# Altium schematic sheet 2_FET_B.SchDoc
size A4; SheetNumber: 4; SheetTotal: 7
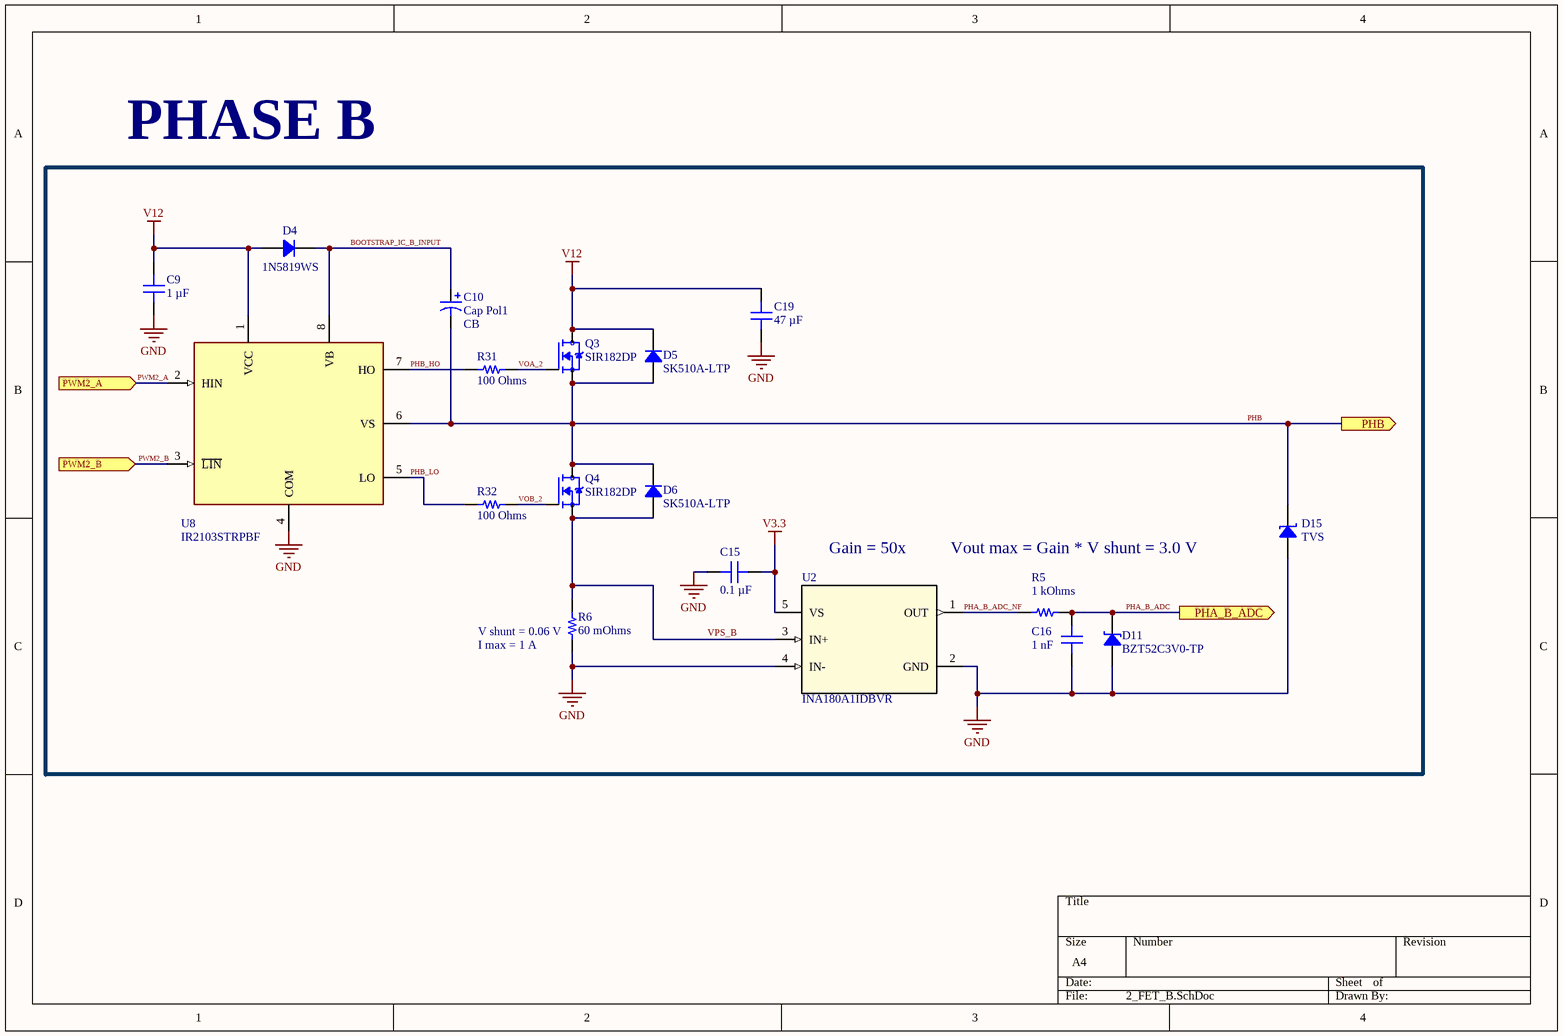
[diagram p0: 2_FET_B.SchDoc]

## Parts
C9  1 µF  [CAP 0805_2012]
C10  Cap Pol1  value CB  [CapacitorRadialElectrolytic]
C15  0.1 µF  [CAP 0805_2012]
C16  1 nF  [CAP 0805_2012]
C19  47 µF  [CAP 1812_4532 1.1MM]
D4  1N5819WS  [SOD-123]
D5  SK510A-LTP  [DO214AC SMA]
D6  SK510A-LTP  [DO214AC SMA]
D11  BZT52C3V0-TP  [SOD-123]
D15  TVS  [SMF DO-219AB]
Q3  SIR182DP  [TRANS_SIR182DP-T1-RE3]
Q4  SIR182DP  [TRANS_SIR182DP-T1-RE3]
R5  1 kOhms  [RES 0805_2012]
R6  60 mOhms  [STACKPOLE CSR2512]
R31  100 Ohms  [RES 0805_2012]
R32  100 Ohms  [RES 0805_2012]
U2  INA180A1IDBVR  [DBV0005A_N]
U8  IR2103STRPBF  [SOIC8_IR2103STRPBF]

## Ports
PHA_B_ADC (out), PHB (out), PWM2_A (in), PWM2_B (in)

## Nets
GND: C9.1 C15.2 C16.2 C19.1 D11.1 D15.1 R6.1 U2.2(GND) U2.4(IN-) U8.4(COM)
V3.3: C15.1 U2.5(VS)
V12: C9.2 C19.2 D4.1 D5.2 Q3.5(D) Q3.6(D) Q3.7(D) Q3.8(D) Q3.9(D) U8.1(VCC)
BOOTSTRAP_IC_B_INPUT: C10.1 D4.2 U8.8(VB)
PHA_B_ADC: C16.1 D11.2 R5.1 ; port PHA_B_ADC
PHA_B_ADC_NF: R5.2 U2.1(OUT)
PHB: C10.2 D5.1 D6.2 D15.2 Q3.1(S) Q3.2(S) Q3.3(S) Q4.5(D) Q4.6(D) Q4.7(D) Q4.8(D) Q4.9(D) U8.6(VS) ; port PHB
PHB_HO: R31.2 U8.7(HO)
PHB_LO: R32.2 U8.5(LO)
PWM2_A: U8.2(HIN) ; port PWM2_A
PWM2_B: U8.3(~{LIN}) ; port PWM2_B
VOA_2: Q3.4(G) R31.1
VOB_2: Q4.4(G) R32.1
VPS_B: D6.1 Q4.1(S) Q4.2(S) Q4.3(S) R6.2 U2.3(IN+)

## Notes on the sheet
- PHASE B
- Gain = 50x
- Vout max = Gain * V shunt = 3.0 V
- (near R6) V shunt = 0.06 V
- (near R6) I max = 1 A

## Library data of the parts
C9 C16 = CC0805MRX7R9BB104: CAP CER 0.1UF 50V X7R 0805; manufacturer: Yageo; Capacitance: 0.1 µF; Tolerance: ±20%; Part Number: CC0805MRX7R9BB104; Applications: General Purpose; componentlink1description: Datasheet; componentlink1url: https://www.yageo.com/upload/media/product/productsearch/datasheet/mlcc/UPY-GPHC_X7R_6.3V-to-50V_18.pdf; componentlink2description: DigiKey Link; componentlink2url: https://www.digikey.com/en/products/detail/yageo/CC0805MRX7R9BB104/5884281; Device Package: 0805 (2012 Metric); lastupdated: 15/11/2023 20:14:20; Lifecycle Status: Active; Minimum Order: 1; Mounting Type: Surface Mount, MLCC; Operating Temperature: -55°C ~ 125°C; Package / Case: 0805 (2012 Metric); packaging: TapeAndReel; partid: 2475; Part Status: Active; price: 0.01; series: CC; Size / Dimension: 0.079" L x 0.049" W (2.00mm x 1.25mm); Supplier 1: DigiKey; Supplier Part Number 1: 311-4351-1-ND; Temperature Coefficient: X7R; Thickness (Max): 0.037" (0.95mm); Voltage - Rated: 50V
  C9: Value: 1 µF
  C16: Value: 1 nF
C10 = Cap Pol1: Polarized Capacitor (Radial); Published: 8-Jun-2000; LatestRevisionDate: 17-Jul-2002; LatestRevisionNote: Re-released for DXP Platform.; PackageReference: RB7.6-15; Publisher: Altium Limited; PackageDescription: Polarized Capacitor (Radial); 2 Leads
C15 = CC0805MRX7R9BB104: CAP CER 0.1UF 50V X7R 0805; manufacturer: Yageo; Tolerance: ±20%; Part Number: CC0805MRX7R9BB104; Value: 0.1 µF; Applications: General Purpose; Capacitance: 0.1 µF; componentlink1description: Datasheet; componentlink1url: https://www.yageo.com/upload/media/product/productsearch/datasheet/mlcc/UPY-GPHC_X7R_6.3V-to-50V_18.pdf; componentlink2description: DigiKey Link; componentlink2url: https://www.digikey.com/en/products/detail/yageo/CC0805MRX7R9BB104/5884281; Device Package: 0805 (2012 Metric); lastupdated: 15/11/2023 20:14:20; Lifecycle Status: Active; Minimum Order: 1; Mounting Type: Surface Mount, MLCC; Operating Temperature: -55°C ~ 125°C; Package / Case: 0805 (2012 Metric); packaging: TapeAndReel; partid: 2475; Part Status: Active; price: 0.01; series: CC; Size / Dimension: 0.079" L x 0.049" W (2.00mm x 1.25mm); Supplier 1: DigiKey; Supplier Part Number 1: 311-4351-1-ND; Temperature Coefficient: X7R; Thickness (Max): 0.037" (0.95mm); Voltage - Rated: 50V
C19 = GMC43X5R476M6R3NT: CAP1812 X5R 47UF 20% 6.3V; manufacturer: Cal-Chip Electronics, Inc.; Part Number: GMC43X5R476M6R3NT; Value: 47 µF; Applications: General Purpose; Capacitance: 47 µF; componentlink1description: Datasheet; componentlink1url: https://88ce57.p3cdn1.secureserver.net/wp-content/uploads/2023/01/gmc_series-2.pdf; componentlink2description: DigiKey Link; componentlink2url: https://www.digikey.com/en/products/detail/cal-chip-electronics-inc/GMC43X5R476M6R3NT/18151147; Device Package: 1812 (4532 Metric); lastupdated: 04/06/2024 19:21:41; Lifecycle Status: Active; Minimum Order: 1; Mounting Type: Surface Mount, MLCC; Operating Temperature: -55°C ~ 85°C; Package / Case: 1812 (4532 Metric); packaging: TapeAndReel; Part Status: Active; price: 0.38; series: GMC; Size / Dimension: 0.177" L x 0.126" W (4.50mm x 3.20mm); Supplier 1: DigiKey; Supplier Part Number 1: 4713-GMC43X5R476M6R3NTCT-ND; Temperature Coefficient: X5R; Thickness (Max): 0.122" (3.10mm); Tolerance: ±20%; Voltage - Rated: 6.3V
D4 = 1N5819HW-7-F: DIODE SCHOTTKY 40V 1A SOD123; Manufacturer: Diodes Incorporated; Capacitance @ Vr, F: 60pF @ 4V, 1MHz; Current - Reverse Leakage @ Vr: 1 mA @ 40 V; Speed: Fast Recovery =< 500ns, > 200mA (Io); Voltage - Forward (Vf) (Max) @ If: 450 mV @ 1 A; Part Number: 1N5819HW-7-F; ComponentLink1Description: Datasheet; ComponentLink1URL: https://www.diodes.com/assets/Datasheets/ds30217.pdf; ComponentLink2Description: DigiKey Link; ComponentLink2URL: https://www.digikey.com/en/products/detail/diodes-incorporated/1N5819HW-7-F/814970; Current - Average Rectified (Io): 1A; Diode Type: Schottky; LastUpdated: 11/03/2024 7:46:34; Lifecycle Status: Active; Minimum Order: 1; Mounting Type: Surface Mount; Operating Temperature - Junction: -65°C ~ 125°C; Package / Case: SOD-123; Packaging: TapeAndReel; PartId: 2212; Part Status: Active; Price: 0.05; Series: -; Supplier 1: DigiKey; Supplier Part Number 1: 1N5819HW-FDICT-ND; Supplier Device Package: SOD-123; Voltage - DC Reverse (Vr) (Max): 40 V
D5 D6 = SK510A-LTP: DIODE SCHOTTKY 100V 5A DO214AC; Manufacturer: Micro Commercial Co; Capacitance @ Vr, F: 200pF @ 4V, 1MHz; Current - Reverse Leakage @ Vr: 1 mA @ 100 V; Speed: Fast Recovery =< 500ns, > 200mA (Io); Voltage - Forward (Vf) (Max) @ If: 850 mV @ 5 A; Part Number: SK510A-LTP; ComponentLink1Description: Datasheet; ComponentLink1URL: https://www.mccsemi.com/pdf/Products/SK52A-L-SK510A-L(DO-214AC).pdf; ComponentLink2Description: DigiKey Link; ComponentLink2URL: https://www.digikey.com/en/products/detail/micro-commercial-co/SK510A-LTP/5114130; Current - Average Rectified (Io): 5A; Diode Type: Schottky; LastUpdated: 29/12/2023 21:23:09; Lifecycle Status: Active; Minimum Order: 1; Mounting Type: Surface Mount; Operating Temperature - Junction: -55°C ~ 150°C; Package / Case: DO-214AC, SMA; Packaging: TapeAndReel; PartId: 2009; Part Status: Active; Price: 0.08; Series: -; Supplier 1: DigiKey; Supplier Part Number 1: SK510A-LTPMSCT-ND; Supplier Device Package: DO-214AC (SMA); Voltage - DC Reverse (Vr) (Max): 100 V
D11 = BZT52C3V0-TP: DIODE ZENER 3V 200MW SOD123; Manufacturer: Micro Commercial Co; Current - Reverse Leakage @ Vr: 10 µA @ 1 V; Impedance (Max) (Zzt): 95 Ohms; Tolerance: ±7%; Voltage - Forward (Vf) (Max) @ If: 900 mV @ 10 mA; Part Number: BZT52C3V0-TP; ComponentLink1Description: Datasheet; ComponentLink1URL: https://www.mccsemi.com/pdf/Products/BZT52C2V4~BZT52C51(500mW)(SOD-123).pdf; ComponentLink2Description: DigiKey Link; ComponentLink2URL: https://www.digikey.com/en/products/detail/micro-commercial-co/BZT52C3V0-TP/806039; LastUpdated: 27/12/2023 21:24:01; Lifecycle Status: Active; Minimum Order: 1; Mounting Type: Surface Mount; Operating Temperature: -65°C ~ 150°C; Package / Case: SOD-123; Packaging: TapeAndReel; PartId: 2097; Part Status: Active; Power - Max: 200 mW; Price: 0.01; Series: -; Supplier 1: DigiKey; Supplier Part Number 1: BZT52C3V0-TPMSCT-ND; Supplier Device Package: SOD-123; Voltage - Zener (Nom) (Vz): 3 V
D15 = VTVS58ASMF-HM3-08: TVS DIODE 57.6V 98V DO219AB; Manufacturer: Vishay Semiconductor Diodes Division; Capacitance @ Frequency: 245pF @ 1MHz; Current - Peak Pulse (10/1000µs): 3.89A; Power Line Protection: No; Power - Peak Pulse: 400W; Type: DO-219AB; Unidirectional Channels: 1; Voltage - Breakdown (Min): 64.6V; Part Number: VTVS58ASMF-HM3-08; Applications: Automotive; ComponentLink1Description: Datasheet; ComponentLink1URL: http://www.vishay.com/docs/85891/vtvs3v3asmf.pdf; ComponentLink2Description: DigiKey Link; ComponentLink2URL: http://digikey.com/product-detail/en/vishay-semiconductor-diodes-division/VTVS58ASMF-HM3-08/112-VTVS58ASMF-HM3-08CT-ND/11562600; LastUpdated: 11/03/2024 8:09:28; Lifecycle Status: Active; Minimum Order: 0; Mounting Type: Surface Mount; Operating Temperature: -55°C ~ 175°C (TJ); Package / Case: DO-219AB; Packaging: TapeAndReel; PartId: 5476; Part Status: -55°C ~ 175°C (TJ); Price: 0.10; Series: Automotive, AEC-Q101, TransZorb®; Supplier 1: DigiKey; Supplier Part Number 1: 112-VTVS58ASMF-HM3-08CT-ND; Supplier Device Package: DO-219AB (SMF); Voltage - Clamping (Max) @ Ipp: 98V; Voltage - Reverse Standoff (Typ): 57.6V
Q3 Q4 = SIR182DP-T1-RE3: N-Channel 60V 60A _Tc_ 69.4W _Tc_ Surface Mount PowerPAKÂ® SO-8; MF: Vishay Siliconix; SnapEDA_Link: https://www.snapeda.com/parts/SIR182DP-T1-RE3/Vishay%20Siliconix/view-part/3228614/?ref=snap; Availability: Unavailable; MP: SIR182DP-T1-RE3; Value: *; Price: None; Package: SO-8 Vishay Siliconix
R5 = CR0805-JW-204ELF: RES SMD 200K OHM 5% 1/8W 0805; Manufacturer: Bourns Inc.; Power (Watts): 0.125W, 1/8W; Resistance: 200 kOhms; Temperature Coefficient: ±200ppm/°C; Part Number: CR0805-JW-204ELF; Value: 1 kOhms; ComponentLink1Description: Datasheet; ComponentLink1URL: https://www.bourns.com/docs/product-datasheets/cr.pdf?sfvrsn=574d41f6_14; ComponentLink2Description: DigiKey Link; ComponentLink2URL: https://www.digikey.com/en/products/detail/bourns-inc/CR0805-JW-204ELF/3785267; Composition: Thick Film; Device Package: 0805 (2012 Metric); Features: Moisture Resistant; Height - Seated (Max): 0.024" (0.60mm); LastUpdated: 02/11/2023 20:02:13; Lifecycle Status: Active; Minimum Order: 1; Number of Terminations: 2; Operating Temperature: -55°C ~ 155°C; Package / Case: 0805 (2012 Metric); Packaging: TapeAndReel; PartId: 69673; Part Status: Active; Price: 0.01; Series: CR0805; Size / Dimension: 0.079" L x 0.049" W (2.00mm x 1.25mm); Supplier 1: DigiKey; Supplier Part Number 1: 118-CR0805-JW-204ELFCT-ND; Supplier Device Package: 0805; Tolerance: ±5%
R6 = CSR2512C0R0005F: RES SMD 500 UOHM 1% 3W 2512; Manufacturer: Riedon; Resistance: 500 µOhms; Temperature Coefficient: ±100ppm/°C; Value: 500 µOhms; Part Number: CSR2512C0R0005F; ComponentLink1Description: Datasheet; ComponentLink1URL: https://riedon.com/media/pdf/CSR.pdf; ComponentLink2Description: DigiKey Link; ComponentLink2URL: http://digikey.com/product-detail/en/riedon/CSR2512C0R0005F/696-1183-1-ND/2813308; Composition: Metal Element; Device Package: 2512 (6432 Metric); Features: Current Sense, Non-Inductive; Height - Seated (Max): 0.057" (1.45mm); LastUpdated: 25/11/2023 21:15:30; Lifecycle Status: Active; Minimum Order: 1; Number of Terminations: 2; Operating Temperature: -55°C ~ 170°C; Packaging: TapeAndReel; PartId: 3098; Part Status: Active; Power (Watts): 3W; Price: 0.20; Series: CSR; Size / Dimension: 0.250" L x 0.118" W (6.35mm x 3.00mm); Supplier 1: DigiKey; Supplier Part Number 1: 696-1183-1-ND; Supplier Device Package: 2512; Tolerance: ±1%
R31 R32 = RCS08054K70JNEA: RES SMD 4.7K OHM 5% 1/2W 0805; Manufacturer: Vishay Dale; Power (Watts): 0.5W, 1/2W; Resistance: 4.7 kOhms; Temperature Coefficient: ±200ppm/°C; Part Number: RCS08054K70JNEA; Value: 100 Ohms; ComponentLink1Description: Datasheet; ComponentLink1URL: http://www.vishay.com/docs/20065/rcse3.pdf; ComponentLink2Description: DigiKey Link; ComponentLink2URL: https://www.digikey.com/en/products/detail/vishay-dale/RCS08054K70JNEA/5867012; Composition: Thick Film; Device Package: 0805 (2012 Metric); Features: Automotive AEC-Q200, Pulse Withstanding; Height - Seated (Max): 0.020" (0.50mm); LastUpdated: 08/02/2024 21:02:38; Lifecycle Status: Active; Minimum Order: 1; Number of Terminations: 2; Operating Temperature: -55°C ~ 155°C; Package / Case: 0805 (2012 Metric); Packaging: TapeAndReel; PartId: 27839; Part Status: Active; Price: 0.02; Ratings: AEC-Q200; Series: RCS e3; Size / Dimension: 0.079" L x 0.049" W (2.00mm x 1.25mm); Supplier 1: DigiKey; Supplier Part Number 1: 541-2866-1-ND; Supplier Device Package: 0805; Tolerance: ±5%
U2 = INA180A1IDBVR: No Description Available; Mfr_Name: Texas Instruments; Type: DEV; RefDes: RefDes; Copyright: Copyright (C) 2023 Ultra Librarian. All rights reserved.; Manufacturer_Part_Number: INA180A1IDBVR
U8 = IR2103STRPBF: Floating channel designed for bootstrap operation | Fully operational to +600 V | Tolerant to negative transient voltage | dV/dt immune | Gate drive supply range from 10 to 20 V | Undervoltage lockout | 3.3 V, 5 V, and 15 V logic input compatible | Cross-conduction prevention logic | Matched propagation delay for both channels | Internal set deadtime | High side output in phase with HIN input | Low side output out of phase with LIN input; MF: Infineon; Availability: Unavailable; Value: *; Package: SOIC-8 International Rectifier; Price: None; MP: IR2103STRPBF; SnapEDA_Link: https://www.snapeda.com/parts/IR2103STRPBF/Infineon%20Technologies/view-part/56821/?ref=snap